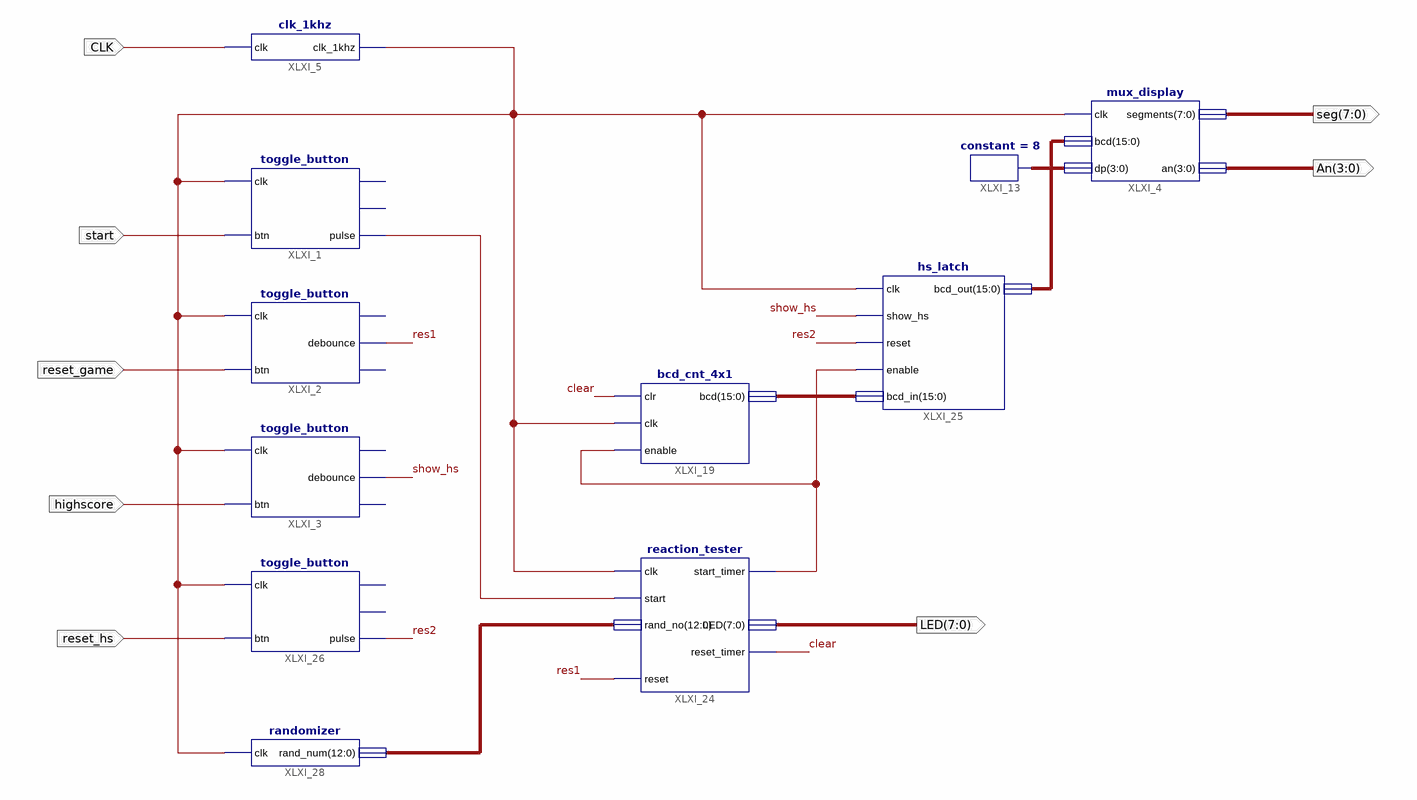
[diagram p0: schematic sheet 1]
// Xilinx ISE schematic Top_layer.sch (spartan3e) as structural Verilog: 11 symbols, 8 ports
module Top_layer (
  input  start,
  input  CLK,
  input  reset_game,
  input  highscore,
  input  reset_hs,
  output [7:0] seg,
  output [3:0] An,
  output [7:0] LED
);

  wire betty, clear, res1, res2, show_hs, XLXN_69, XLXN_89;
  wire [3:0] XLXN_27;
  wire [12:0] XLXN_112;
  wire [15:0] XLXN_86, XLXN_87;

  mux_display XLXI_4 (.clk(betty), .bcd(XLXN_87), .dp(XLXN_27), .segments(seg), .an(An));
  clk_1khz XLXI_5 (.clk(CLK), .clk_1khz(betty));
  toggle_button XLXI_1 (.clk(betty), .btn(start), .pulse(XLXN_69));  // open: toggle, debounce
  toggle_button XLXI_2 (.clk(betty), .btn(reset_game), .debounce(res1));  // open: toggle, pulse
  toggle_button XLXI_3 (.clk(betty), .btn(highscore), .debounce(show_hs));  // open: toggle, pulse
  constant #(.CValue("8")) XLXI_13 (.O(XLXN_27));
  bcd_cnt_4x1 XLXI_19 (.clr(clear), .clk(betty), .enable(XLXN_89), .bcd(XLXN_86));
  reaction_tester XLXI_24 (
    .clk(betty), .start(XLXN_69), .rand_no(XLXN_112), .reset_timer(clear), .start_timer(XLXN_89), .LED(LED),
    .reset(res1));
  hs_latch XLXI_25 (
    .clk(betty), .show_hs(show_hs), .reset(res2), .enable(XLXN_89), .bcd_in(XLXN_86), .bcd_out(XLXN_87));
  toggle_button XLXI_26 (.clk(betty), .btn(reset_hs), .pulse(res2));  // open: toggle, debounce
  randomizer XLXI_28 (.clk(betty), .rand_num(XLXN_112));
endmodule
